# EAGLE design 6809_BASIC (EAGLE 7.1.0)
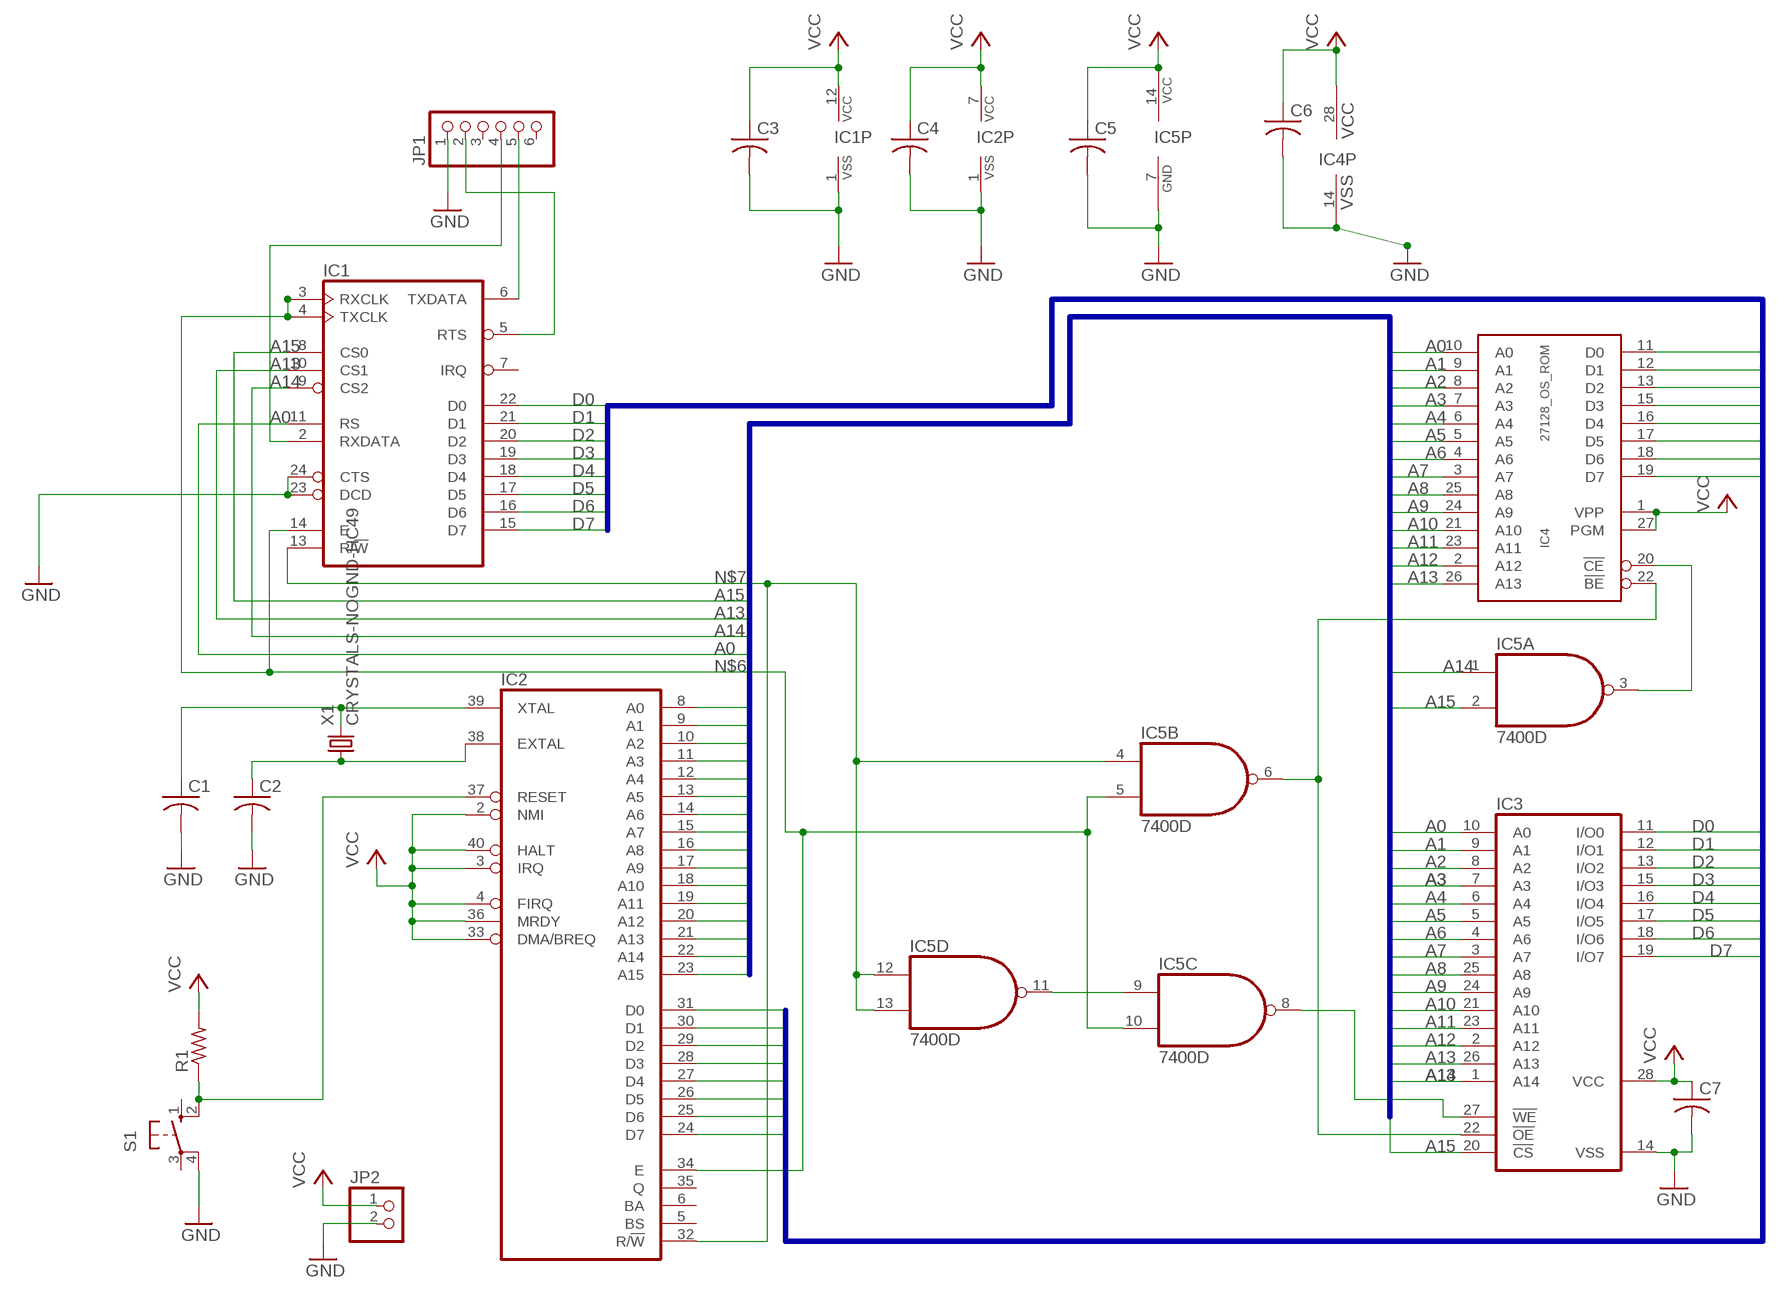
[diagram p0: schematic, sheet 1]

## Parts
C1  C-USC1608  [C1608]
C2  C-USC1608  [C1608]
C3  C-USC1608  [C1608]
C4  C-USC1608  [C1608]
C5  C-USC1608  [C1608]
C6  C-USC1608  [C1608]
C7  C-USC1608  [C1608]
IC1  6850  [DIL24]
IC2  6809  [DIL40]
IC3  62256P  [DIL28-6]
IC4  27128_OS_ROM  [DIL28]
IC5  7400D  [SO14]
JP1  HEADER-1X6  [1X06_OVAL]
JP2  HEADER-1X2  [1X02_OVAL]
R1  R-US_R0603  [R0603]
S1  10-XX  [B3F-10XX]
X1  CRYSTALS-NOGND-HC49  [HC49]

## Nets
A0: IC1.11(RS) IC2.8(A0) IC3.10(A0) IC4.10(A0)
A1: IC2.9(A1) IC3.9(A1) IC4.9(A1)
A2: IC2.10(A2) IC3.8(A2) IC4.8(A2)
A3: IC2.11(A3) IC3.7(A3) IC4.7(A3)
A4: IC2.12(A4) IC3.6(A4) IC4.6(A4)
A5: IC2.13(A5) IC3.5(A5) IC4.5(A5)
A6: IC2.14(A6) IC3.4(A6) IC4.4(A6)
A7: IC2.15(A7) IC3.3(A7) IC4.3(A7)
A8: IC2.16(A8) IC3.25(A8) IC4.25(A8)
A9: IC2.17(A9) IC3.24(A9) IC4.24(A9)
A10: IC2.18(A10) IC3.21(A10) IC4.21(A10)
A11: IC2.19(A11) IC3.23(A11) IC4.23(A11)
A12: IC2.20(A12) IC3.2(A12) IC4.2(A12)
A13: IC1.10(CS1) IC2.21(A13) IC3.26(A13) IC4.26(A13)
A14: IC1.9(CS2) IC2.22(A14) IC3.1(A14) IC5.1(A:I0)
A15: IC1.8(CS0) IC2.23(A15) IC3.20(!CS) IC5.2(A:I1)
D0: IC1.22(D0) IC2.31(D0) IC3.11(I/O0) IC4.11(D0)
D1: IC1.21(D1) IC2.30(D1) IC3.12(I/O1) IC4.12(D1)
D2: IC1.20(D2) IC2.29(D2) IC3.13(I/O2) IC4.13(D2)
D3: IC1.19(D3) IC2.28(D3) IC3.15(I/O3) IC4.15(D3)
D4: IC1.18(D4) IC2.27(D4) IC3.16(I/O4) IC4.16(D4)
D5: IC1.17(D5) IC2.26(D5) IC3.17(I/O5) IC4.17(D5)
D6: IC1.16(D6) IC2.25(D6) IC3.18(I/O6) IC4.18(D6)
D7: IC1.15(D7) IC2.24(D7) IC3.19(I/O7) IC4.19(D7)
GND: C1.2 C2.2 C3.2 C4.2 C5.2 C6.2 C7.2 IC1.1(VSS) IC1.23(DCD) IC1.24(CTS) IC2.1(VSS) IC3.14(VSS) IC4.14(VSS) IC5.7(P:GND) JP1.1 JP2.2 S1.4(P1)
N$1: IC3.27(!WE) IC5.8(C:O)
N$2: IC3.22(!OE) IC4.22(!BE) IC5.6(B:O)
N$4: IC5.9(C:I0) IC5.11(D:O)
N$5: IC4.20(!CE) IC5.3(A:O)
N$6: IC1.3(RXCLK) IC1.4(TXCLK) IC1.14(E) IC2.34(E) IC5.5(B:I1) IC5.10(C:I1)
N$7: IC1.13(R/!W) IC2.32(R/!W) IC5.4(B:I0) IC5.12(D:I0) IC5.13(D:I1)
N$9: C2.1 IC2.38(EXTAL) X1.1
N$10: C1.1 IC2.39(XTAL) X1.2
N$12: IC2.37(RESET) R1.1 S1.2(S1)
N$18: IC1.6(TXDATA) JP1.5
N$19: IC1.2(RXDATA) JP1.4
N$20: IC1.5(RTS) JP1.2
VCC: C3.1 C4.1 C5.1 C6.1 C7.1 IC1.12(VCC) IC2.2(NMI) IC2.3(IRQ) IC2.4(FIRQ) IC2.7(VCC) IC2.33(DMA/BREQ) IC2.36(MRDY) IC2.40(HALT) IC3.28(VCC) IC4.1(VPP) IC4.27(PGM) IC4.28(VCC) IC5.14(P:VCC) JP2.1 R1.2
Unconnected: IC1.7(IRQ) IC2.5(BS) IC2.6(BA) IC2.35(Q) JP1.3 JP1.6 S1.1(S) S1.3(P)

## Buses
D[0..7]
A[0..15]

## Library data of the parts
C1-C7 = resistor:C-US: CAPACITOR, American symbol
IC1 = micro-motorola:6850: MICROCONTROLLER/MEMORY DEVICE; MF: NTE ELECTRONICS; MPN: NTE6850; OC_FARNELL: 4899775; OC_NEWARK: 31C2457
IC2 = micro-motorola:6809: MICROCONTROLLER/MEMORY DEVICE; MF: NTE ELECTRONICS; MPN: NTE6809; OC_FARNELL: 4530354; OC_NEWARK: 31C2459
IC3 = memory-hitachi:62256P: MEMORY; OC_FARNELL: unknown; OC_NEWARK: unknown
IC4 = eagle-6.5.0-atari:27128_OS_ROM: 16K x 8 PROM
IC5 = 74xx-us:74*00: Quad 2-input NAND gate
JP1 = OLED_mod:HEADER-1X6: PIN HEADER
JP2 = OLED_mod:HEADER-1X2: PIN HEADER
R1 = rcl:R-US_: RESISTOR, American symbol
S1 = switch-omron:10-XX: OMRON SWITCH; MPN: B3F-1000; OC_FARNELL: 176432; OC_NEWARK: 36M3542
X1 = IQD-Frequency-Products:CRYSTALS-NOGND: CRYSTALS CAN NOT GROUNDED

## Board
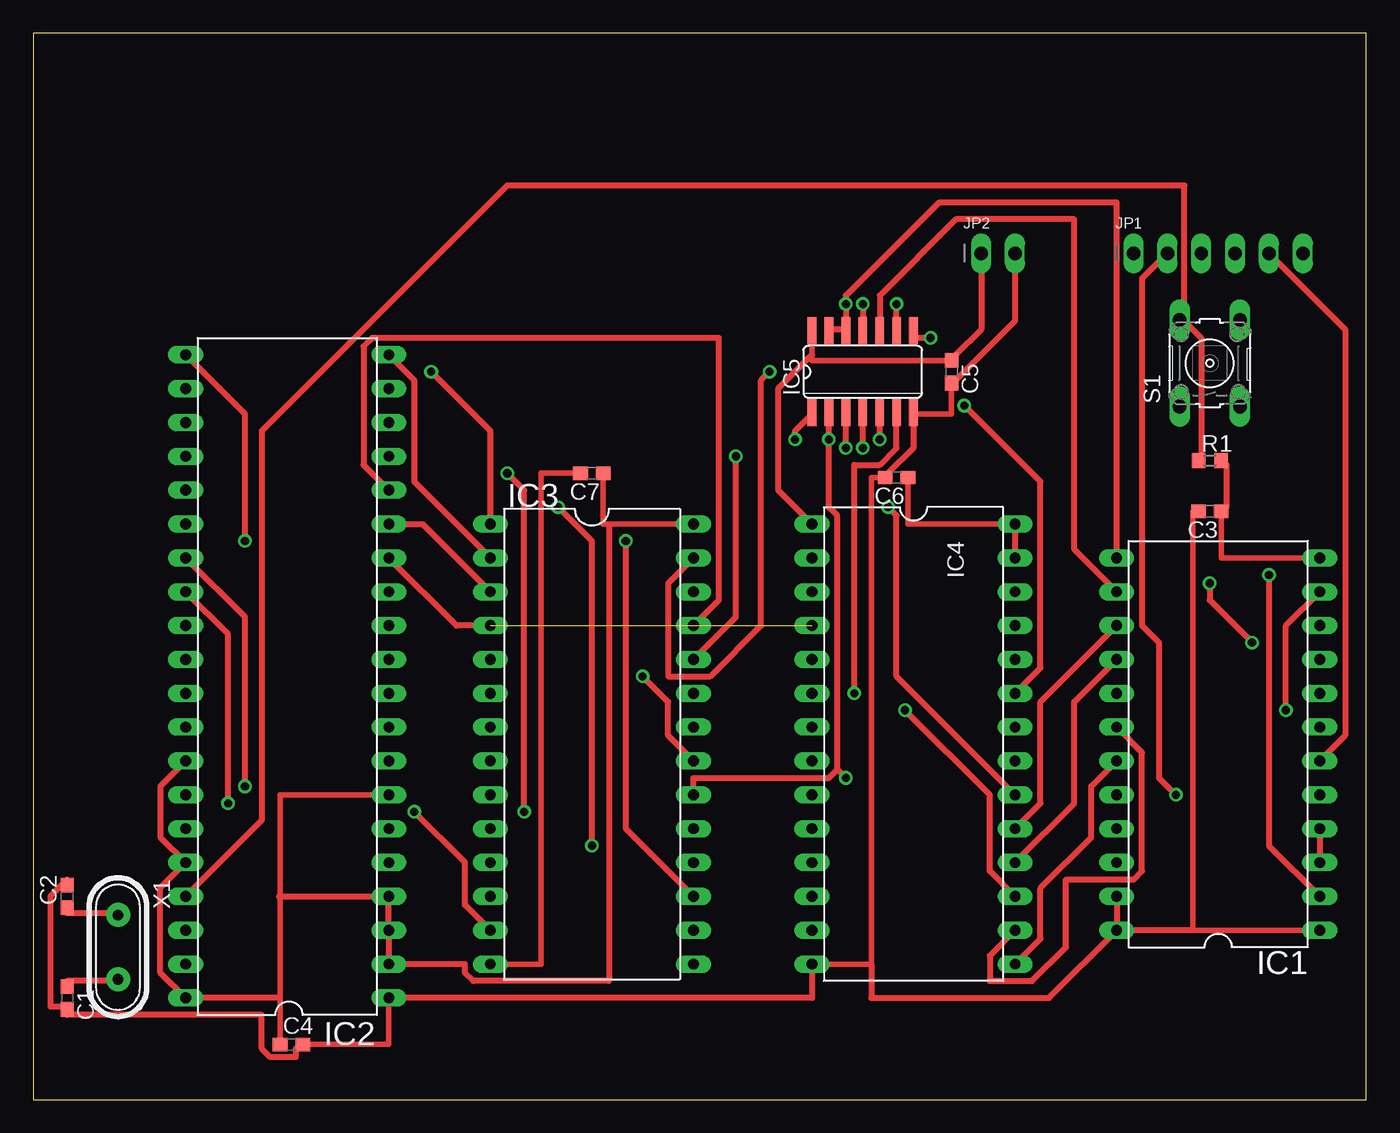
[diagram p1: board, top side]
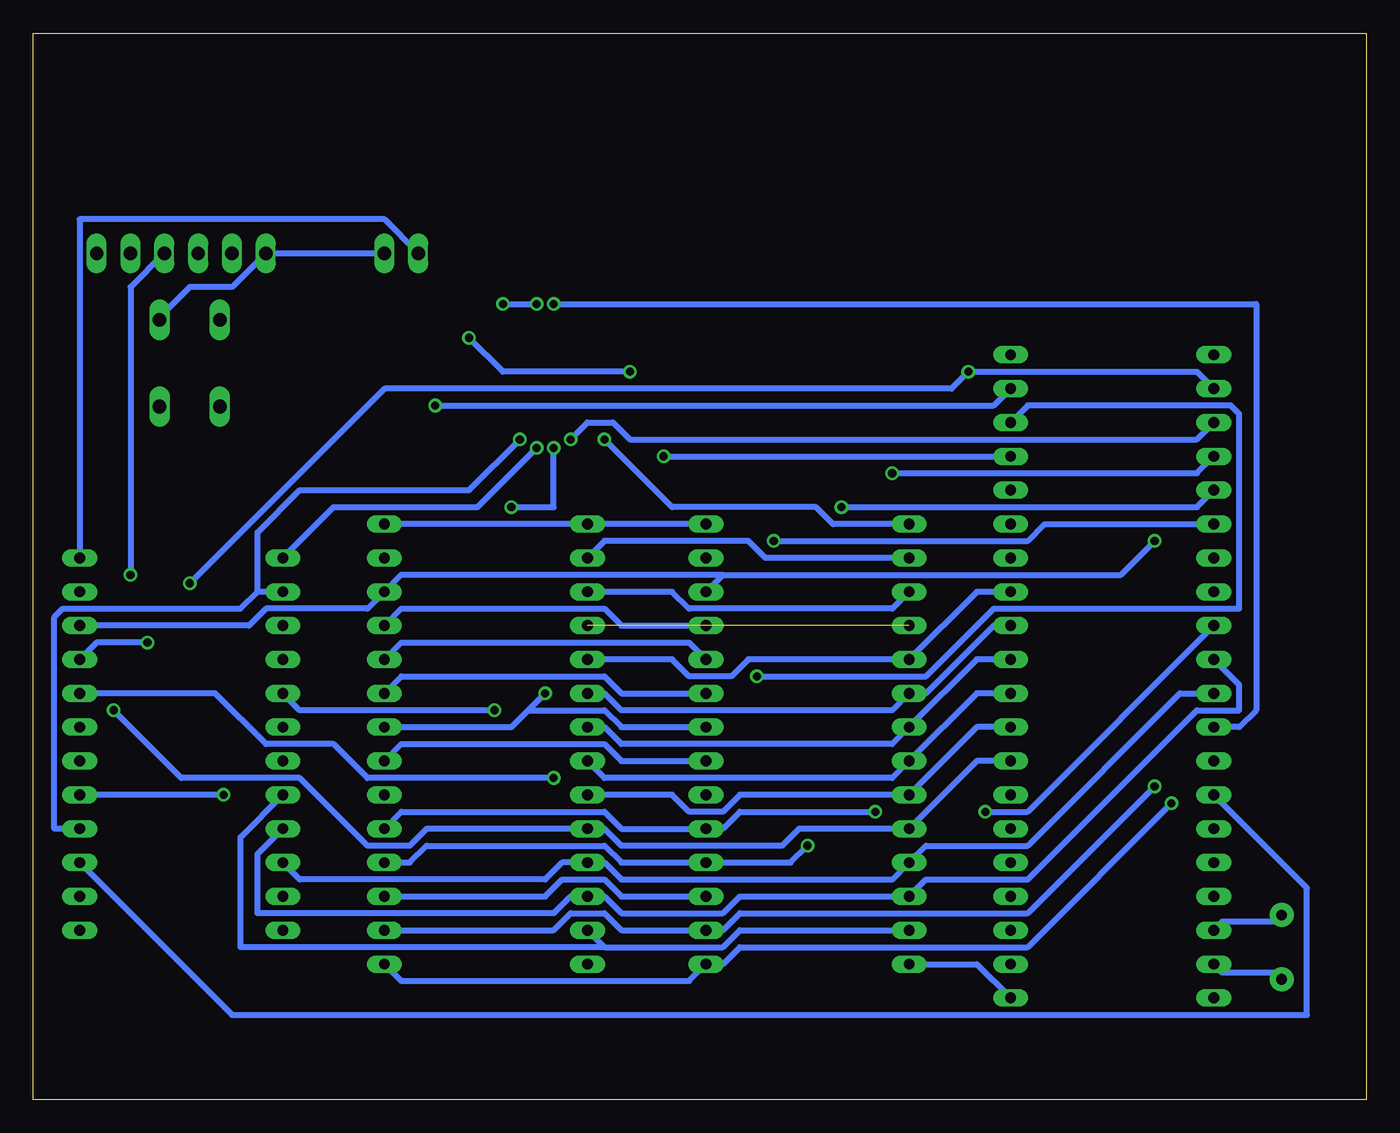
[diagram p2: board, bottom side, seen from below]

Size 100 x 80 mm. Coordinates in mm from the lower left corner, seen from the top.
Outline: 0,0 100,0 100,80 0,80 0,0
Copper layers (1*16): Top 0.035mm / dielectric 1.5mm / Bottom 0.035mm
Design rules "default *": minimum track width 18mil, minimum drill 24mil, track to track 14mil, track to pad 8mil, pad to pad 8mil, via to via 8mil, smd to smd 8mil, copper to edge 40mil, drill to drill 8mil, minimum pad ring 10mil, minimum via ring 8mil, stop-mask expansion 4mil, vias tented up to drill 0mil, thermal gap 10mil
vRestrict: area 57.5,52.4 to 67,56.5

### Footprints (pad centres in the part's own frame; a part is rotated, then mirrored left to right if it is on the bottom)
C1608 = smd 1.1 x 1: 1 -0.85,0; 2 0.85,0
DIL24 = drill 0.813 long: 1 -13.97,-7.62; 2 -11.43,-7.62; 3 -8.89,-7.62; 4 -6.35,-7.62; 5 -3.81,-7.62; 6 -1.27,-7.62; 7 1.27,-7.62; 8 3.81,-7.62; 9 6.35,-7.62; 10 8.89,-7.62; 11 11.43,-7.62; 12 13.97,-7.62; 13 13.97,7.62; 14 11.43,7.62; 15 8.89,7.62; 16 6.35,7.62; 17 3.81,7.62; 18 1.27,7.62; 19 -1.27,7.62; 20 -3.81,7.62; 21 -6.35,7.62; 22 -8.89,7.62; 23 -11.43,7.62; 24 -13.97,7.62
DIL40 = drill 0.813 long: 1 -24.13,-7.62; 2 -21.59,-7.62; 3 -19.05,-7.62; 4 -16.51,-7.62; 5 -13.97,-7.62; 6 -11.43,-7.62; 7 -8.89,-7.62; 8 -6.35,-7.62; 9 -3.81,-7.62; 10 -1.27,-7.62; 11 1.27,-7.62; 12 3.81,-7.62; 13 6.35,-7.62; 14 8.89,-7.62; 15 11.43,-7.62; 16 13.97,-7.62; 17 16.51,-7.62; 18 19.05,-7.62; 19 21.59,-7.62; 20 24.13,-7.62; 21 24.13,7.62; 22 21.59,7.62; 23 19.05,7.62; 24 16.51,7.62; 25 13.97,7.62; 26 11.43,7.62; 27 8.89,7.62; 28 6.35,7.62; 29 3.81,7.62; 30 1.27,7.62; 31 -1.27,7.62; 32 -3.81,7.62; 33 -6.35,7.62; 34 -8.89,7.62; 35 -11.43,7.62; 36 -13.97,7.62; 37 -16.51,7.62; 38 -19.05,7.62; 39 -21.59,7.62; 40 -24.13,7.62
DIL28-6 = drill 0.813 long: 1 -16.51,-7.62; 2 -13.97,-7.62; 3 -11.43,-7.62; 4 -8.89,-7.62; 5 -6.35,-7.62; 6 -3.81,-7.62; 7 -1.27,-7.62; 8 1.27,-7.62; 9 3.81,-7.62; 10 6.35,-7.62; 11 8.89,-7.62; 12 11.43,-7.62; 13 13.97,-7.62; 14 16.51,-7.62; 15 16.51,7.62; 16 13.97,7.62; 17 11.43,7.62; 18 8.89,7.62; 19 6.35,7.62; 20 3.81,7.62; 21 1.27,7.62; 22 -1.27,7.62; 23 -3.81,7.62; 24 -6.35,7.62; 25 -8.89,7.62; 26 -11.43,7.62; 27 -13.97,7.62; 28 -16.51,7.62
DIL28 = drill 0.813 long: 1 -16.51,-7.62; 2 -13.97,-7.62; 3 -11.43,-7.62; 4 -8.89,-7.62; 5 -6.35,-7.62; 6 -3.81,-7.62; 7 -1.27,-7.62; 8 1.27,-7.62; 9 3.81,-7.62; 10 6.35,-7.62; 11 8.89,-7.62; 12 11.43,-7.62; 13 13.97,-7.62; 14 16.51,-7.62; 15 16.51,7.62; 16 13.97,7.62; 17 11.43,7.62; 18 8.89,7.62; 19 6.35,7.62; 20 3.81,7.62; 21 1.27,7.62; 22 -1.27,7.62; 23 -3.81,7.62; 24 -6.35,7.62; 25 -8.89,7.62; 26 -11.43,7.62; 27 -13.97,7.62; 28 -16.51,7.62
SO14 = smd 0.66 x 2.032: 1 -3.81,-3.073; 2 -2.54,-3.073; 3 -1.27,-3.073; 4 0,-3.073; 5 1.27,-3.073; 6 2.54,-3.073; 7 3.81,-3.073; 8 3.81,3.073; 9 2.54,3.073; 10 1.27,3.073; 11 0,3.073; 12 -1.27,3.073; 13 -2.54,3.073; 14 -3.81,3.073
1X06_OVAL = drill 1 long: 1 -6.35,0; 2 -3.81,0; 3 -1.27,0; 4 1.27,0; 5 3.81,0; 6 6.35,0
1X02_OVAL = drill 1 long: 1 -1.27,0; 2 1.27,0
R0603 = smd 1 x 1.1: 1 -0.85,0; 2 0.85,0
B3F-10XX = drill 1.016 long: 1 -3.251,2.261; 2 3.251,2.261; 3 -3.251,-2.261; 4 3.251,-2.261
HC49 = drill 0.813 pad 1.8: 1 -2.413,0; 2 2.413,0

### Placement (x,y rotation side)
C1  2.54,7.62 270 top
C2  2.54,15.24 90 top
C3  88.27,44.13 180 top
C4  19.37,4.13 0 top
C5  68.9,54.61 270 top
C6  64.77,46.67 180 top
C7  41.91,46.99 180 top
IC1  88.9,26.67 90 top
IC2  19.05,31.75 90 top
IC3  41.91,26.67 270 top
IC4  66.04,26.67 270 top
IC5  62.23,54.61 0 top
JP1  88.9,63.5 0 top
JP2  72.39,63.5 0 top
R1  88.27,47.94 0 top
S1  88.27,55.24 90 top
X1  6.35,11.43 270 top

### Tracks (layer width: path | path; a pad name or v marks a point on that pad's centre or on a via)
A0  (via drill 0.61)
  Top 0.457: IC1.11 93.98,35.56 v93.98,29.21
  Bottom 0.457: IC2.8 29.21,25.4 IC3.10 42.55,20.32 43.81,19.05 55.88,19.05 57.15,20.32 IC4.10 70.48,20.32 71.75,19.05 74.93,19.05 80.01,24.13 88.9,24.13 v93.98,29.21
A1
  Bottom 0.457: IC2.9 29.21,27.94 IC3.9 46.99,22.86 48.26,21.59 50.8,21.59 52.07,22.86 IC4.9
A2
  Bottom 0.457: IC2.10 29.21,30.48 IC3.8 35.56,24.13 57.15,24.13 IC4.8
A3
  Bottom 0.457: IC2.11 29.21,33.02 IC3.7 35.56,26.67 55.88,26.67 57.15,27.94 IC4.7
A4
  Bottom 0.457: IC2.12 27.94,35.56 33.02,30.48 IC3.6 35.56,29.21 55.88,29.21 57.15,30.48 IC4.6
A5
  Bottom 0.457: IC2.13 29.21,38.1 IC3.5 46.35,33.02 47.62,31.75 50.8,31.75 52.07,33.02 IC4.5
A6  (1 unrouted)
  Top 0.457: IC2.14 31.75,35.56 IC3.4
A7
  Top 0.457: IC3.3 29.21,43.18 IC2.15
  Bottom 0.457: IC4.3 52.07,38.1 50.8,36.83 35.56,36.83 IC3.3
A8
  Top 0.457: IC2.16 24.77,47.62 24.77,56.52 25.4,57.15 51.44,57.15 51.44,37.47 IC3.25
  Bottom 0.457: IC3.25 55.88,35.56 57.15,36.83 72.39,36.83 IC4.25
A9  (via drill 0.61)
  Top 0.457: v52.7,48.26 52.7,36.2 IC3.24
  Bottom 0.457: IC3.24 50.8,34.29 72.39,34.29 IC4.24 | v52.7,48.26 IC2.17
A10  (via drill 0.61)
  Top 0.457: v45.72,31.75 47.62,29.84 47.62,27.3 IC3.21
  Bottom 0.457: IC3.21 55.88,25.4 57.15,26.67 72.39,26.67 IC4.21 | IC2.18 25.4,52.07 10.16,52.07 9.53,51.44 9.53,36.83 27.94,36.83 33.02,31.75 v45.72,31.75
A11  (via drill 0.61)
  Top 0.457: v69.85,52.07 75.56,46.35 75.56,32.38 IC4.23
  Bottom 0.457: IC3.23 55.88,30.48 57.15,31.75 72.39,31.75 IC4.23 | IC2.19 27.94,52.07 v69.85,52.07
A12
  Top 0.457: IC3.2 28.57,46.35 28.57,53.98 IC2.20
  Bottom 0.457: IC4.2 57.15,41.91 46.35,41.91 45.09,40.64 IC3.2
A13  (via drill 0.61)
  Top 0.457: IC2.21 15.88,51.44 v15.88,41.91
  Bottom 0.457: v15.88,41.91 18.41,39.37 48.26,39.37 | IC3.26 48.26,39.37 | 48.26,39.37 72.39,39.37 IC4.26 74.93,36.83 82.55,36.83 83.82,35.56 IC1.10
A14  (via drill 0.61)
  Top 0.457: v57.15,49.53 57.15,50.16 58.42,51.44 IC5.1 | v29.84,54.61 34.29,50.16 IC3.1 | v91.44,34.29 88.27,37.47 v88.27,38.73
  Bottom 0.457: v57.15,49.53 52.07,44.45 41.27,44.45 40.01,43.18 IC3.1 | IC2.22 12.7,54.61 v29.84,54.61 31.11,53.34 73.66,53.34 v88.27,38.73 | IC1.9 95.25,34.29 v91.44,34.29
A15  (via drill 0.61)
  Top 0.457: IC5.2 v59.69,49.53 59.69,44.45 60.33,43.81 60.33,24.77 | 60.33,24.77 59.69,24.13 49.53,24.13 IC3.20 | 60.33,24.77 v60.96,24.13
  Bottom 0.457: IC2.23 12.7,49.53 55.24,49.53 56.52,50.8 58.42,50.8 v59.69,49.53 | IC1.8 86.36,30.48 82.55,26.67 77.47,26.67 74.93,24.13 v60.96,24.13
D0
  Bottom 0.457: IC1.22 80.01,16.51 61.59,16.51 60.33,17.78 IC4.11 57.15,17.78 55.88,16.51 35.56,16.51 IC3.11 33.02,19.05 25.4,19.05 13.97,30.48 IC2.31
D1
  Bottom 0.457: IC2.30 9.53,31.11 9.53,29.21 12.7,29.21 25.4,16.51 33.02,16.51 IC3.12 46.99,15.24 48.26,13.97 55.88,13.97 57.15,15.24 IC4.12 59.69,15.24 60.96,13.97 83.19,13.97 83.19,18.41 IC1.21
D2  (via drill 0.61)
  Top 0.457: v28.57,21.59 32.38,17.78 32.38,14.61 IC3.13
  Bottom 0.457: IC3.13 46.99,12.7 48.26,11.43 57.15,11.43 | IC4.13 57.15,11.43 | IC2.29 25.4,21.59 v28.57,21.59 | IC1.20 84.45,19.68 84.45,11.43 57.15,11.43
D3  (via drill 0.61)
  Top 0.457: IC2.28 14.61,34.92 v14.61,22.23 | IC1.19 79.38,23.5 79.38,19.68 75.56,15.88 75.56,12.06 IC4.15
  Bottom 0.457: IC4.15 72.39,8.89 50.8,8.89 IC3.15 48.26,10.16 46.99,11.43 25.4,11.43 v14.61,22.23
D4  (via drill 0.61)
  Top 0.457: IC2.27 15.88,36.2 v15.88,23.5 | IC1.18 83.19,26.04 83.19,17.14 82.55,16.51 77.47,16.51 77.47,11.43 74.93,8.89 71.75,8.89 71.75,10.79 IC4.16
  Bottom 0.457: IC4.16 60.96,12.7 59.69,13.97 57.15,13.97 55.88,12.7 IC3.16 48.26,12.7 46.99,13.97 25.4,13.97 v15.88,23.5
D5  (via drill 0.61)
  Top 0.457: v44.45,41.91 44.45,20.32 IC3.17 | v65.41,29.21 71.75,22.86 71.75,17.14 IC4.17
  Bottom 0.457: IC3.17 55.88,15.24 57.15,16.51 60.33,16.51 61.59,15.24 IC4.17 | IC2.26 24.13,43.18 25.4,41.91 v44.45,41.91 | IC1.17 80.01,29.21 v65.41,29.21
D6  (via drill 0.61)
  Top 0.457: v39.37,44.45 41.91,41.91 v41.91,19.05 | IC1.16 78.11,29.84 78.11,22.23 IC4.18
  Bottom 0.457: IC4.18 71.75,17.78 70.48,19.05 57.15,19.05 55.88,17.78 IC3.18 43.18,17.78 v41.91,19.05 | IC2.25 12.7,44.45 v39.37,44.45
D7  (via drill 0.61)
  Top 0.457: v35.56,46.99 36.83,45.72 v36.83,21.59 | IC1.15 75.56,29.84 75.56,22.23 IC4.19
  Bottom 0.457: IC4.19 72.39,21.59 57.15,21.59 55.88,20.32 IC3.19 48.26,20.32 46.99,21.59 v36.83,21.59 | IC2.24 12.7,46.99 v35.56,46.99
GND
  Top 0.406: C4.2 26.67,4.13 IC2.1 | C7.2 38.1,46.99 38.1,10.16 IC3.14 | C6.2 62.87,46.67 62.87,10.16 IC4.14 | C3.2 87,44.13 87,12.7 IC1.1 | C5.2 68.9,51.44 66.04,51.44
  Top 0.457: C2.2 2.54,16.51 1.27,15.24 1.27,6.99 2.54,6.99 C1.2 2.54,6.35 17.14,6.35 17.14,3.81 17.78,3.17 19.68,3.17 19.68,3.81 C4.2 | IC1.23 IC1.24 | 87,12.7 IC1.24 | IC1.24 76.2,7.62 62.87,7.62 62.87,10.16 | JP2.2 73.66,58.42 69.22,53.98 C5.2 | C6.2 64.14,46.99 66.04,48.9 66.04,51.44 IC5.7 | IC2.1 58.42,7.62 IC4.14
  Bottom 0.457: IC2.1 29.21,10.16 IC3.14 | JP2.2 JP1.1 85.09,60.96 88.27,60.96 90.17,59.05 S1.4
N$1  (via drill 0.61)
  Top 0.457: v67.31,57.15 66.04,57.15 IC5.8 | v55.24,54.61 54.61,53.98 54.61,35.56 50.8,31.75 47.62,31.75 47.62,38.73 IC3.27
  Bottom 0.457: v67.31,57.15 64.77,54.61 v55.24,54.61
N$2  (via drill 0.61)
  Top 0.457: IC5.6 64.77,48.9 63.5,47.62 61.59,47.62 v61.59,30.48
  Bottom 0.457: 62.87,29.21 64.14,27.94 IC4.22 | 62.87,29.21 v61.59,30.48 | IC3.22 55.88,27.94 57.15,29.21 62.87,29.21
N$4  (via drill 0.61)
  Top 0.457: v62.23,59.69 IC5.11 | IC5.9 v64.77,59.69
  Bottom 0.457: v64.77,59.69 v62.23,59.69
N$5  (via drill 0.61)
  Top 0.457: v60.96,48.9 IC5.3 | v64.14,44.45 64.77,43.81 64.77,31.75 IC4.20
  Bottom 0.457: v60.96,48.9 60.96,44.45 v64.14,44.45
N$6  (via drill 0.61)
  Top 0.457: v63.5,49.53 IC5.5 | IC5.10 63.5,60.33 69.22,66.04 78.11,66.04 78.11,41.27 IC1.14 | IC1.4 IC1.3
  Bottom 0.457: v63.5,49.53 67.31,45.72 80.01,45.72 83.19,42.55 83.19,38.1 | IC1.14 83.19,38.1 | IC2.34 4.45,15.88 4.45,6.35 85.09,6.35 IC1.3 | 83.19,38.1 84.45,36.83 97.79,36.83 98.42,36.2 98.42,20.32 IC1.4
N$7  (via drill 0.61)
  Top 0.457: 60.96,57.78 59.69,57.78 IC5.13 | v62.23,48.9 IC5.4 | 60.96,57.78 v60.96,59.69 60.96,60.33 67.94,67.31 81.28,67.31 IC1.13 | 60.96,57.78 IC5.12
  Bottom 0.457: v62.23,48.9 66.67,44.45 77.47,44.45 IC1.13 | IC2.32 9.53,27.94 8.26,29.21 8.26,59.69 v60.96,59.69
N$9
  Top 0.457: C2.1 2.54,13.97 6.35,13.97 X1.1
  Bottom 0.457: IC2.38 10.79,13.34 6.35,13.34 X1.1
N$10
  Top 0.457: C1.1 2.54,8.89 6.35,8.89 X1.2
  Bottom 0.457: IC2.39 10.79,9.53 6.35,9.53 X1.2
N$12
  Top 0.457: R1.1 87.63,48.26 87.63,57.15 86.36,58.42 S1.2 86.36,59.05 86.36,68.58 35.56,68.58 17.14,50.16 17.14,20.95 IC2.37
N$18
  Top 0.457: IC1.6 98.42,27.3 98.42,57.78 JP1.5
N$19  (via drill 0.61)
  Top 0.457: IC1.2 92.71,19.05 v92.71,39.37
  Bottom 0.457: v92.71,39.37 92.71,60.96 JP1.4
N$20  (via drill 0.61)
  Top 0.457: v85.72,22.86 84.45,24.13 84.45,34.29 83.19,35.56 83.19,61.59 JP1.2
  Bottom 0.457: v85.72,22.86 IC1.5
VCC
  Top 0.406: IC2.7 18.52,22.86 18.52,15.24 18.52,7.62 C4.1 | IC3.28 43.18,43.18 42.76,43.18 C7.1 | IC4.28 65.62,43.18 C6.1 | IC1.12 89.11,40.64 C3.1 | C5.1 58.42,55.46 58.42,55.88 IC5.14
  Top 0.457: IC2.33 9.53,23.5 9.53,19.68 IC2.36 9.53,15.88 9.53,9.53 IC2.40 18.52,7.62 | 18.41,15.24 18.52,15.24 IC2.4 IC2.3 IC2.2 32.38,10.16 32.38,9.53 33.02,8.89 43.18,8.89 43.18,43.18 | IC4.28 IC4.27 | R1.2 89.53,47.62 89.53,44.45 C3.1 | JP2.1 71.12,57.78 69.22,55.88 C5.1 | IC4.1 55.88,45.72 55.88,53.34 58.42,55.88
  Bottom 0.457: IC3.28 IC4.1 IC4.28 | IC1.12 96.52,66.04 73.66,66.04 JP2.1